# EAGLE design nuc10breakout (EAGLE 7.4.0)
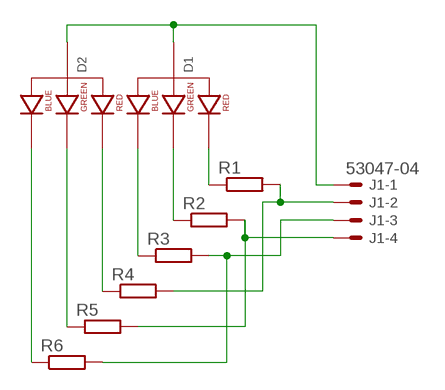
[diagram p0: schematic, sheet 1]

## Parts
D1  LED-RGB-CA-THRUDIFFUSE  [LED-RGB-THRU]
D2  LED-RGB-CA-THRUDIFFUSE  [LED-RGB-THRU]
J1  53047-04  [53047-04]
R1  R-EU_0204/5  [0204/5]
R2  R-EU_0204/5  [0204/5]
R3  R-EU_0204/5  [0204/5]
R4  R-EU_0204/5  [0204/5]
R5  R-EU_0204/5  [0204/5]
R6  R-EU_0204/5  [0204/5]

## Nets
N$1: J1.2 R1.2 R4.2
N$2: J1.4 R2.2 R5.2
N$3: J1.3 R3.2 R6.2
N$4: D1.1(RED_CATHODE) R1.1
N$5: D1.3(GREEN_CATHODE) R2.1
N$6: D1.4(BLUE_CATHODE) R3.1
N$7: D1.2(ANODE) D2.2(ANODE) J1.1
N$8: D2.1(RED_CATHODE) R4.1
N$9: D2.3(GREEN_CATHODE) R5.1
N$10: D2.4(BLUE_CATHODE) R6.1

## Library data of the parts
D1 D2 = SparkFun-LED:LED-RGB-CA-THRU: RGB Through-hole common anode SparkFun store front COM-10821 (diffuse) COM-10820 (clear); PROD_ID: DIO-10632
J1 = con-molex:53?-04: CONNECTOR wire to board 1.25 mm (.049 inch) pitch header; MF: WALDOM/MOLEX; MPN: 53047-0410; OC_FARNELL: 9733060; OC_NEWARK: 38C9900
R1-R6 = rcl:R-EU_: RESISTOR, European symbol

## Board
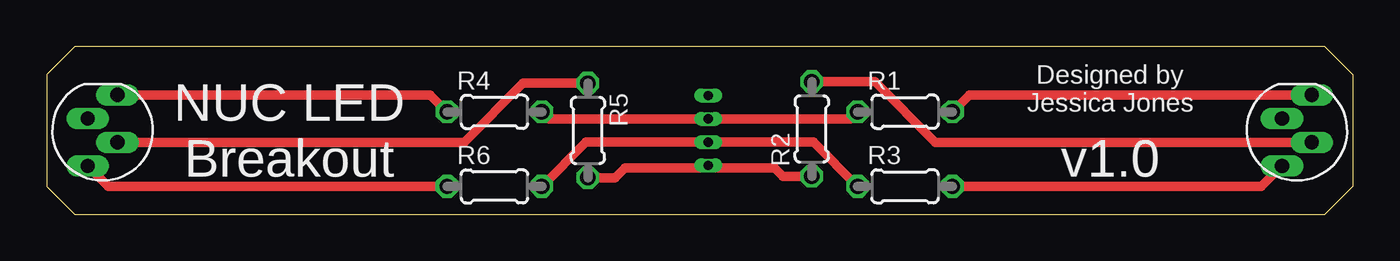
[diagram p1: board, top side]
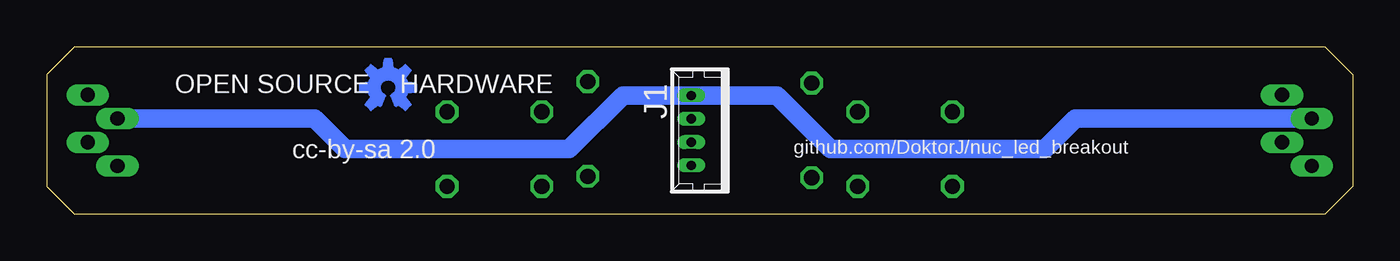
[diagram p2: board, bottom side, seen from below]

Size 70 x 9 mm. Coordinates in mm from the lower left corner, seen from the top.
Outline: 1.5,0 68.5,0 70,1.5 70,7.5 68.5,9 1.5,9 0,7.5 0,1.5 1.5,0
Copper layers (1*16): Top 0.035559375mm / dielectric 1.6mm / Bottom 0.035559375mm
Design rules "oshpark-2layer": minimum track width 6mil, minimum drill 10mil, track to track 6mil, track to pad 6mil, pad to pad 6mil, via to via 6mil, smd to smd 6mil, copper to edge 15mil, drill to drill 6mil, minimum pad ring 5mil, minimum via ring 5mil, stop-mask expansion 2.5mil, vias tented up to drill 0mil, thermal gap 10mil

### Footprints (pad centres in the part's own frame; a part is rotated, then mirrored left to right if it is on the bottom)
LED-RGB-THRU = drill 0.762 pad 0.889 long: 1 1.905,-0.8; 2 0.635,0.8; 3 -0.635,-0.8; 4 -1.905,0.8
53047-04 = drill 0.5 pad 0.698 long: 1 1.875,0.45; 2 0.625,0.45; 3 -0.625,0.45; 4 -1.875,0.45
0204/5 = drill 0.813 octagon: 1 -2.54,0; 2 2.54,0

### Placement (x,y rotation side)
D1  67,4.5 90 top
D2  3,4.5 90 top
J1  35,4.5 90 bottom
R1  46,5.5 180 top
R2  41,4.58 270 top
R3  46,1.5 180 top
R4  24,5.5 0 top
R5  29,4.5 270 top
R6  24,1.5 0 top
U$1  [OSHW-LOGO-S_COPPER]  51.7,6.8 0 bottom

### Tracks (layer width: path | path; a pad name or v marks a point on that pad's centre or on a via)
N$1
  Top 0.5: R4.2 26.91,5.12 J1.2 43.09,5.12 R1.2
N$2
  Top 0.5: R5.2 30.46,1.96 31,2.5 35.33,2.5 J1.4 35.58,2.5 39,2.5 39.46,2.04 R2.2
N$3
  Top 0.5: R6.2 28.91,3.88 J1.3 41.09,3.88 R3.2
N$4
  Top 0.5: R1.1 49.45,6.41 D1.1
N$5
  Top 0.5: R2.1 44.38,7.12 47.63,3.87 D1.3
N$6
  Top 0.5: R3.1 65.11,1.5 D1.4
N$7
  Bottom 1: D1.2 55.63,5.13 54,3.5 42,3.5 39.12,6.38 J1.1 30.88,6.38 28,3.5 16.5,3.5 14.87,5.13 D2.2
N$8
  Top 0.5: R4.1 20.55,6.41 D2.1
N$9
  Top 0.5: R5.1 25.54,7.04 22.36,3.87 D2.3
N$10
  Top 0.5: R6.1 3.29,1.5 D2.4

### Text on the board
tTest: 0 | 10 | 20 | 30 | 40 | 50 | 60 | 70 | 80
_tsilk: Designed by / Jessica Jones | NUC LED / Breakout | v1.0
_bsilk: OPEN SOURCE HARDWARE | github.com/DoktorJ/nuc_led_breakout | cc-by-sa 2.0